# Altium schematic sheet CC0603KRX7R9BB104.schdoc
size 127 x 101 mm
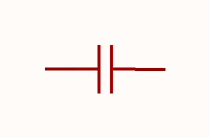
[diagram p0: CC0603KRX7R9BB104.schdoc]

## Parts
C?  cc0603krx7r9bb104  [C0603]  (value not drawn)

## Nets

Not connected (* = marked no-connect by the designer): C? 1 2

## Library data of the parts
C? = cc0603krx7r9bb104: 容值:100nF;精度:±10%;额定电压:50V;温度系数:X7R;; Manufacturer: YAGEO(国巨); AddInBom: yes; ModelId: ac125912035d415993ca9572d50418b1; ModelName: C0603_L1.6-W0.8-H0.8; ModelTransform: 62.992,31.496,0,0,0,0,0,0,0; Value: 100nF; Tolerance: ±10%; Voltage Rating: 50V; Temperature Coefficient: X7R; Symbol: CC0603KRX7R9BB104; LCSC Part Name: 100nF ±10% 50V; SupplierPart: C14663; ManufacturerPart: CC0603KRX7R9BB104; Supplier Footprint: 0603; JLCPCB Part Class: Basic Part; Datasheet: https://item.szlcsc.com/datasheet/CC0603KRX7R9BB104/15331.html; Supplier: LCSC; ConvertToPcb: yes; FootprintName: C0603